# EAGLE design piezo-driver_v0.1-R002 (EAGLE 6.5.0)
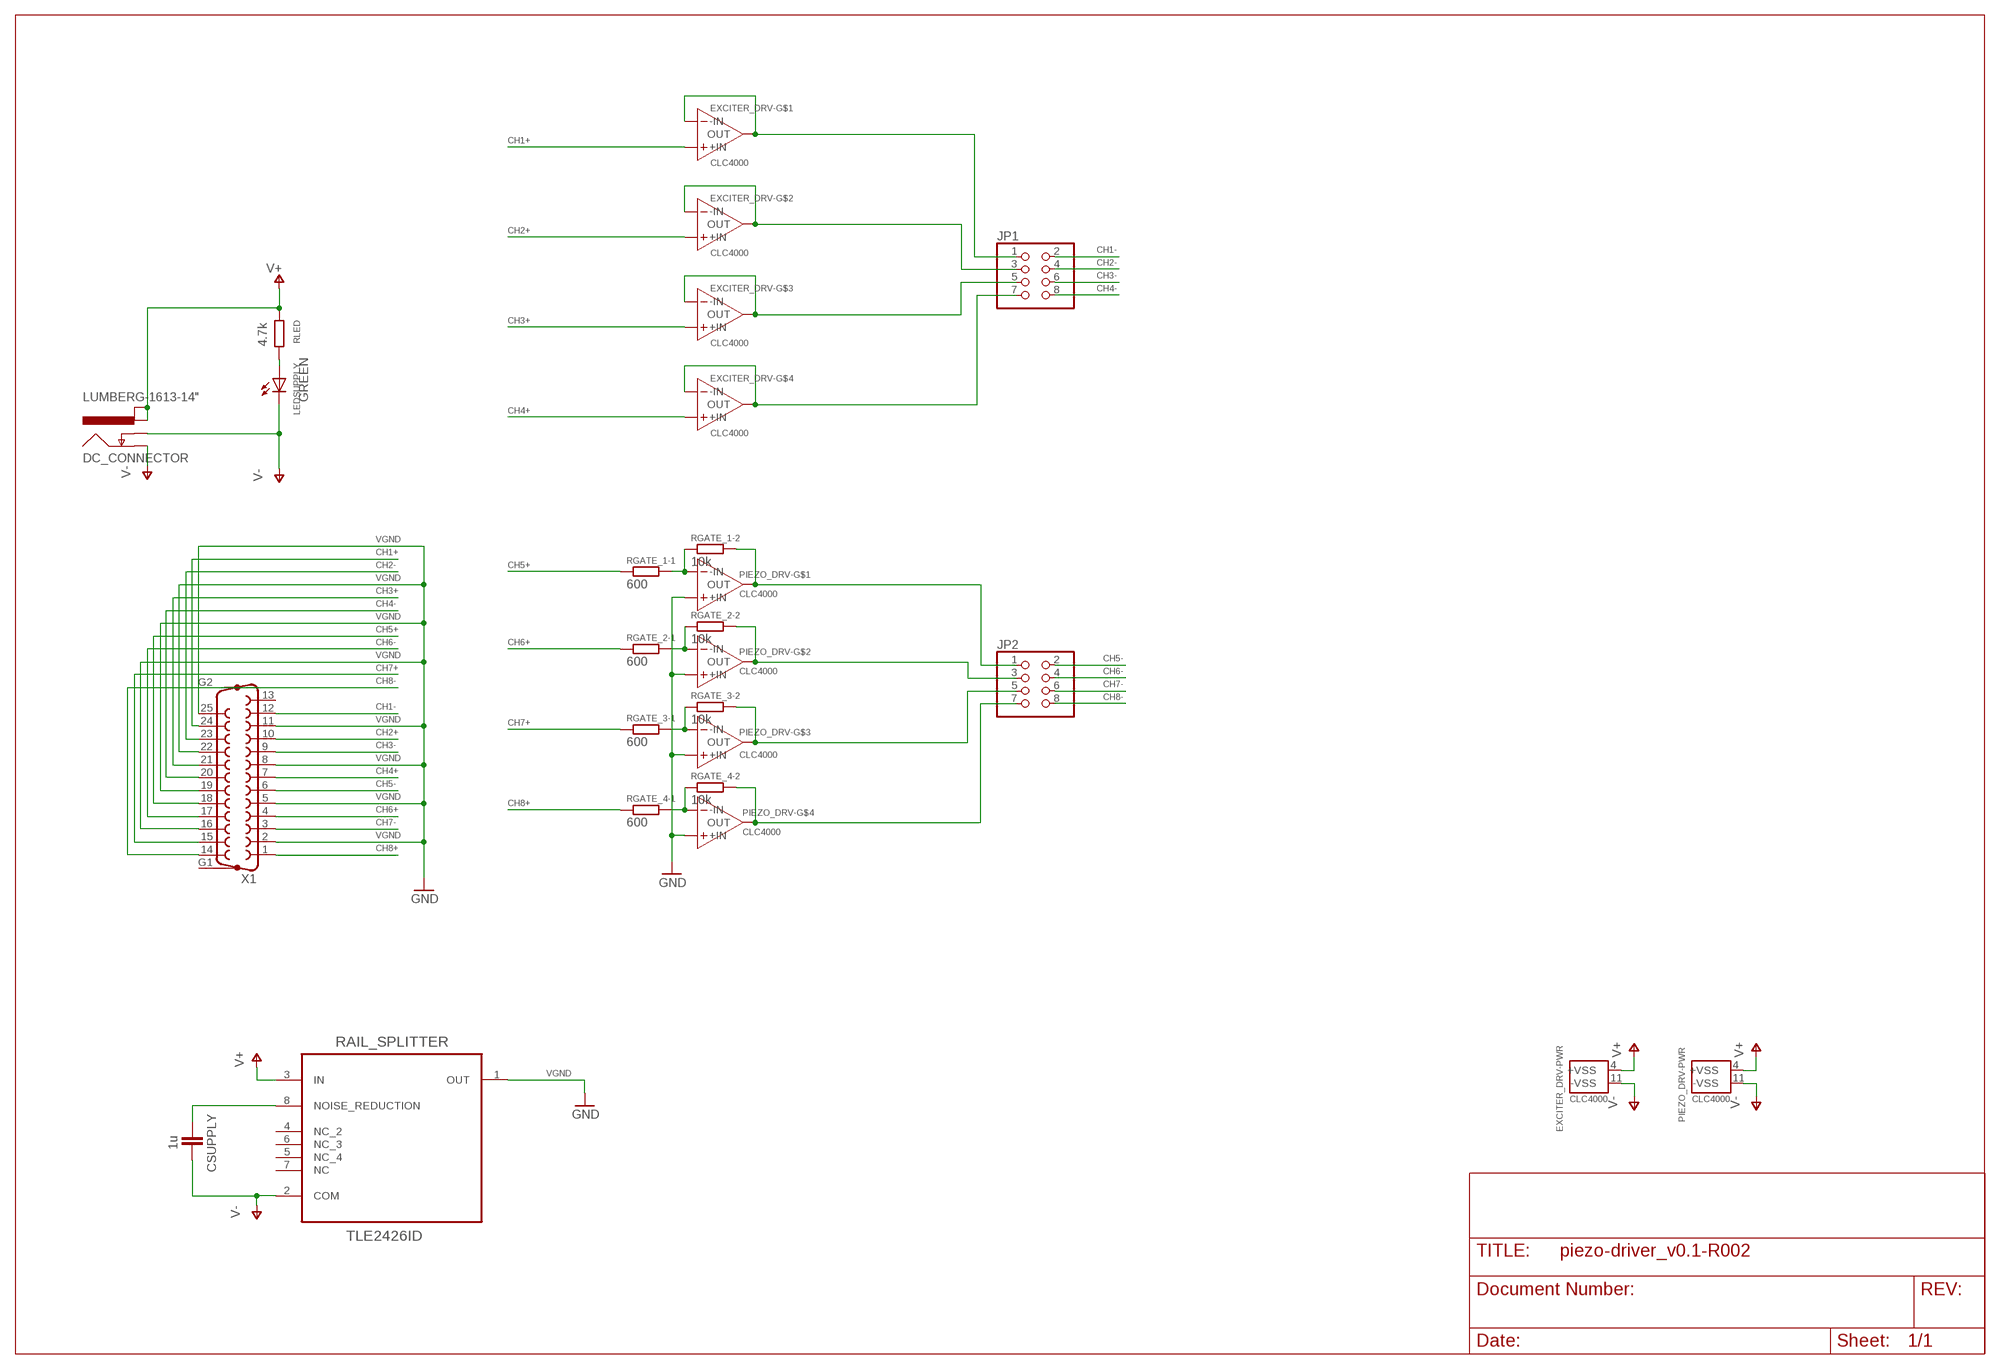
[diagram p0: schematic, sheet 1]

## Parts
CSUPPLY  1u  C-EUC0603  [C0603]
DC_CONNECTOR  LUMBERG-1613-14"  [LUMBERG-1613_14]
EXCITER_DRV  CLC4000  [SOIC-14]
JP1  PINHD-2X4/90  [2X04/90]
JP2  PINHD-2X4/90  [2X04/90]
LEDSUPPLY  GREEN  LED3MM  [LED3MM]
PIEZO_DRV  CLC4000  [SOIC-14]
RAIL_SPLITTER  TLE2426ID  [SOIC127P600X175-8N]
RGATE_1-1  600  R-EU_R0805  [R0805]
RGATE_1-2  10k  R-EU_R0805  [R0805]
RGATE_2-1  600  R-EU_R0805  [R0805]
RGATE_2-2  10k  R-EU_R0805  [R0805]
RGATE_3-1  600  R-EU_R0805  [R0805]
RGATE_3-2  10k  R-EU_R0805  [R0805]
RGATE_4-1  600  R-EU_R0805  [R0805]
RGATE_4-2  10k  R-EU_R0805  [R0805]
RLED  4.7k  R-EU_R0805  [R0805]
X1  F25HP  [F25HP]

## Nets
CH1+: EXCITER_DRV.3(-G$1:+IN) X1.24
CH1-: JP1.2 X1.12
CH2+: EXCITER_DRV.5(-G$2:+IN) X1.10
CH2-: JP1.4 X1.23
CH3+: EXCITER_DRV.10(-G$3:+IN) X1.21
CH3-: JP1.6 X1.9
CH4+: EXCITER_DRV.12(-G$4:+IN) X1.7
CH4-: JP1.8 X1.20
CH5+: RGATE_1-1.1 X1.18
CH5-: JP2.2 X1.6
CH6+: RGATE_2-1.1 X1.4
CH6-: JP2.4 X1.17
CH7+: RGATE_3-1.1 X1.15
CH7-: JP2.6 X1.3
CH8+: RGATE_4-1.1 X1.1
CH8-: JP2.8 X1.14
N$1: EXCITER_DRV.1(-G$1:OUT) EXCITER_DRV.2(-G$1:-IN) JP1.1
N$2: EXCITER_DRV.6(-G$2:-IN) EXCITER_DRV.7(-G$2:OUT) JP1.3
N$3: EXCITER_DRV.8(-G$3:OUT) EXCITER_DRV.9(-G$3:-IN) JP1.5
N$4: EXCITER_DRV.13(-G$4:-IN) EXCITER_DRV.14(-G$4:OUT) JP1.7
N$5: CSUPPLY.1 RAIL_SPLITTER.8(NOISE_REDUCTION)
N$6: PIEZO_DRV.2(-G$1:-IN) RGATE_1-1.2 RGATE_1-2.1
N$7: JP2.1 PIEZO_DRV.1(-G$1:OUT) RGATE_1-2.2
N$8: PIEZO_DRV.6(-G$2:-IN) RGATE_2-1.2 RGATE_2-2.1
N$9: JP2.3 PIEZO_DRV.7(-G$2:OUT) RGATE_2-2.2
N$10: PIEZO_DRV.9(-G$3:-IN) RGATE_3-1.2 RGATE_3-2.1
N$11: JP2.5 PIEZO_DRV.8(-G$3:OUT) RGATE_3-2.2
N$12: PIEZO_DRV.13(-G$4:-IN) RGATE_4-1.2 RGATE_4-2.1
N$13: JP2.7 PIEZO_DRV.14(-G$4:OUT) RGATE_4-2.2
N$15: LEDSUPPLY.A RLED.1
V+: DC_CONNECTOR.3(PWR_1) DC_CONNECTOR.4(PWR_2) EXCITER_DRV.4(-PWR:+VSS) PIEZO_DRV.4(-PWR:+VSS) RAIL_SPLITTER.3(IN) RLED.2
V-: CSUPPLY.2 DC_CONNECTOR.1(GND) DC_CONNECTOR.2(GND_INS) EXCITER_DRV.11(-PWR:-VSS) LEDSUPPLY.K(C) PIEZO_DRV.11(-PWR:-VSS) RAIL_SPLITTER.2(COM)
VGND: PIEZO_DRV.3(-G$1:+IN) PIEZO_DRV.5(-G$2:+IN) PIEZO_DRV.10(-G$3:+IN) PIEZO_DRV.12(-G$4:+IN) RAIL_SPLITTER.1(OUT) X1.2 X1.5 X1.8 X1.11 X1.16 X1.19 X1.22 X1.25 ; supply symbol labelled GND
Unconnected: RAIL_SPLITTER.4(NC_2) RAIL_SPLITTER.5(NC_4) RAIL_SPLITTER.6(NC_3) RAIL_SPLITTER.7(NC) X1.13 X1.G1 X1.G2

## Library data of the parts
CSUPPLY = rcl:C-EU: CAPACITOR, European symbol
DC_CONNECTOR = SABRe:LUMBERG-1613-14
EXCITER_DRV PIEZO_DRV = ICST:CLC4000
JP1 JP2 = ICST:PINHD-2X4: PIN HEADER
LEDSUPPLY = SABRe:LED: LEDs Standard schematic elements and footprints for packages: 5mm 3mm 1206 0603
RAIL_SPLITTER = Texas Instruments_By_element14_Batch_1:TLE2426ID: PRECISION VIRTUAL GROUND; MPN: TLE2426ID; OC_FARNELL: 8454833; OC_NEWARK: 35K1234; PACKAGE: SOIC-8; SUPPLIER: Texas Instruments
RGATE_1-1 RGATE_1-2 RGATE_2-1 RGATE_2-2 RGATE_3-1 RGATE_3-2 RGATE_4-1 RGATE_4-2 RLED = rcl:R-EU_: RESISTOR, European symbol
X1 = ICST:F25HP: SUB-D; OC_FARNELL: unknown; OC_NEWARK: unknown

## Board
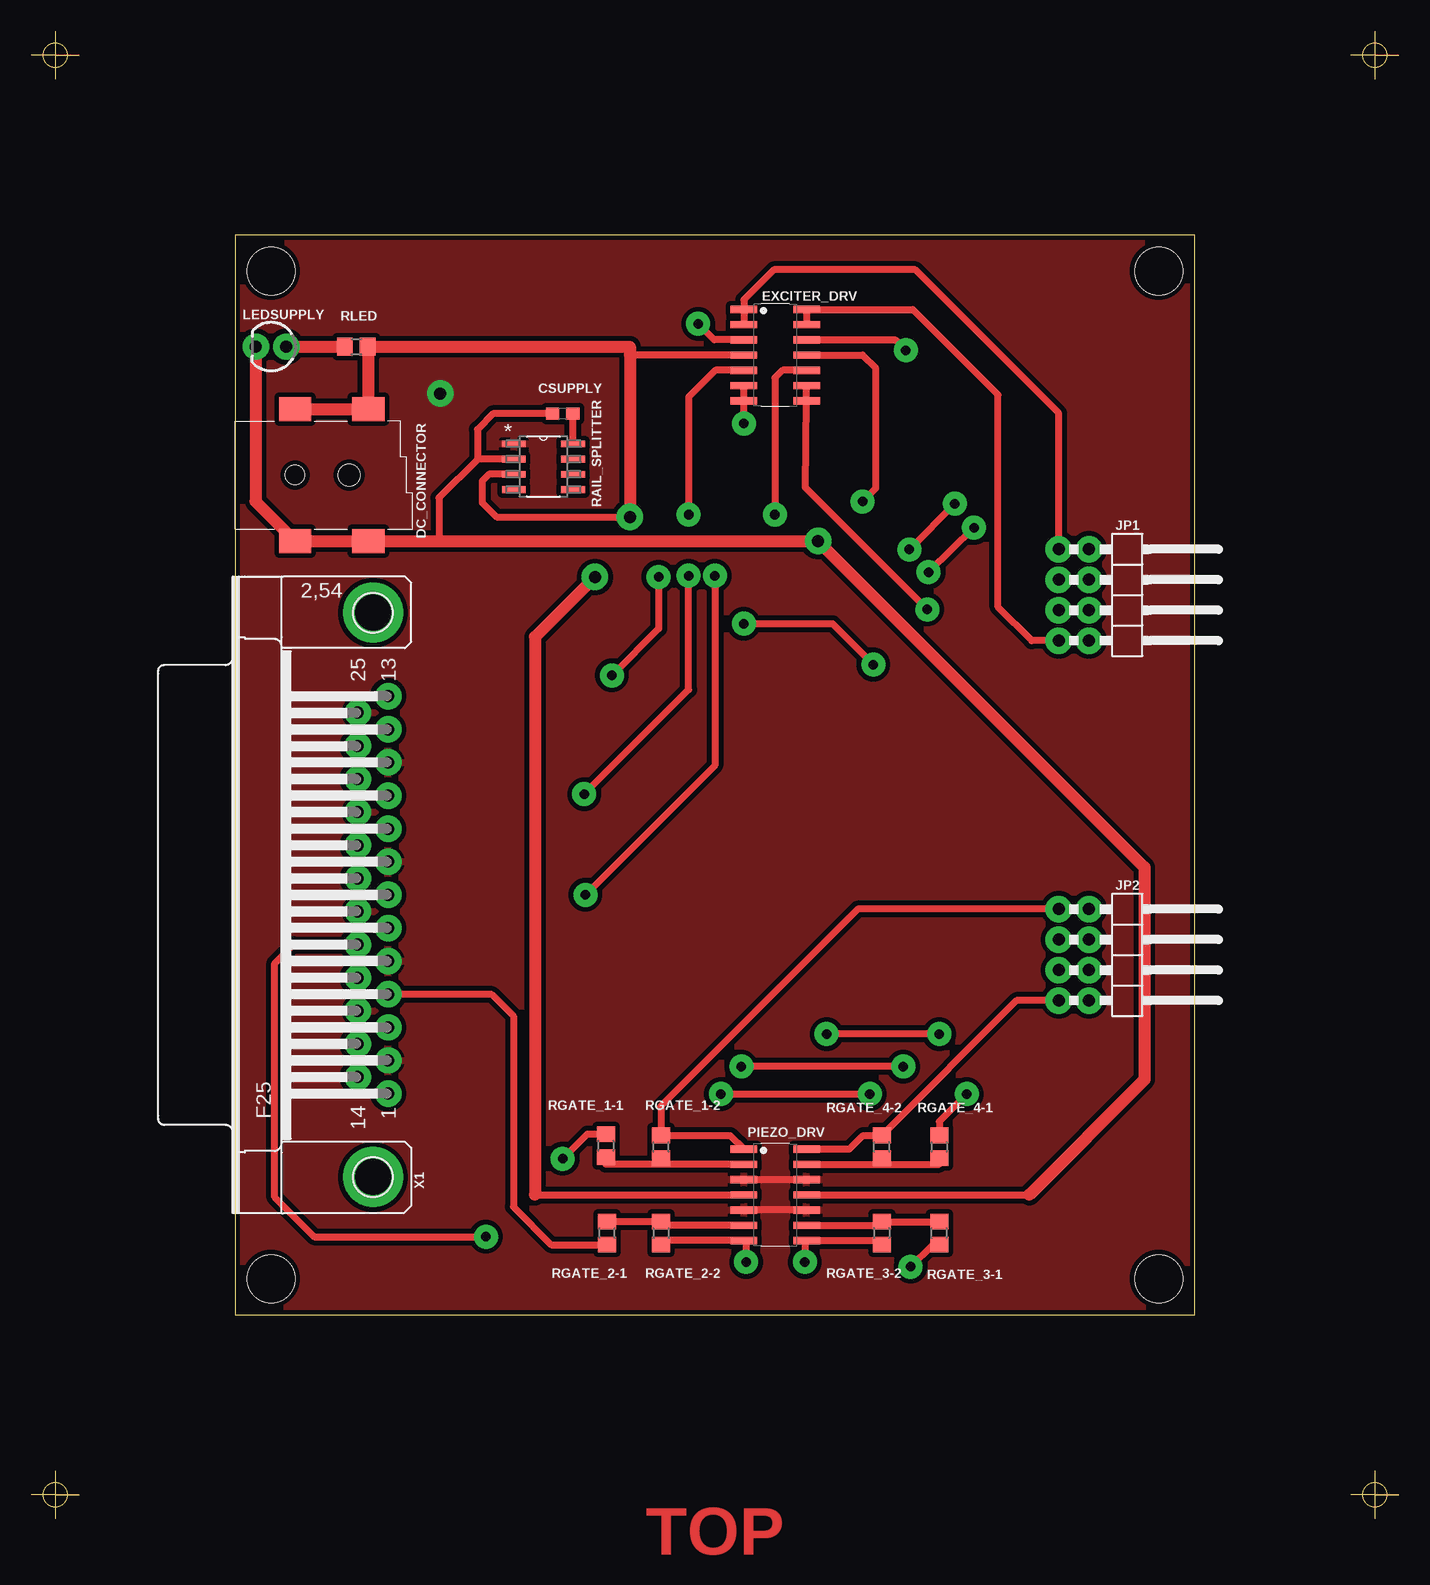
[diagram p1: board, top side]
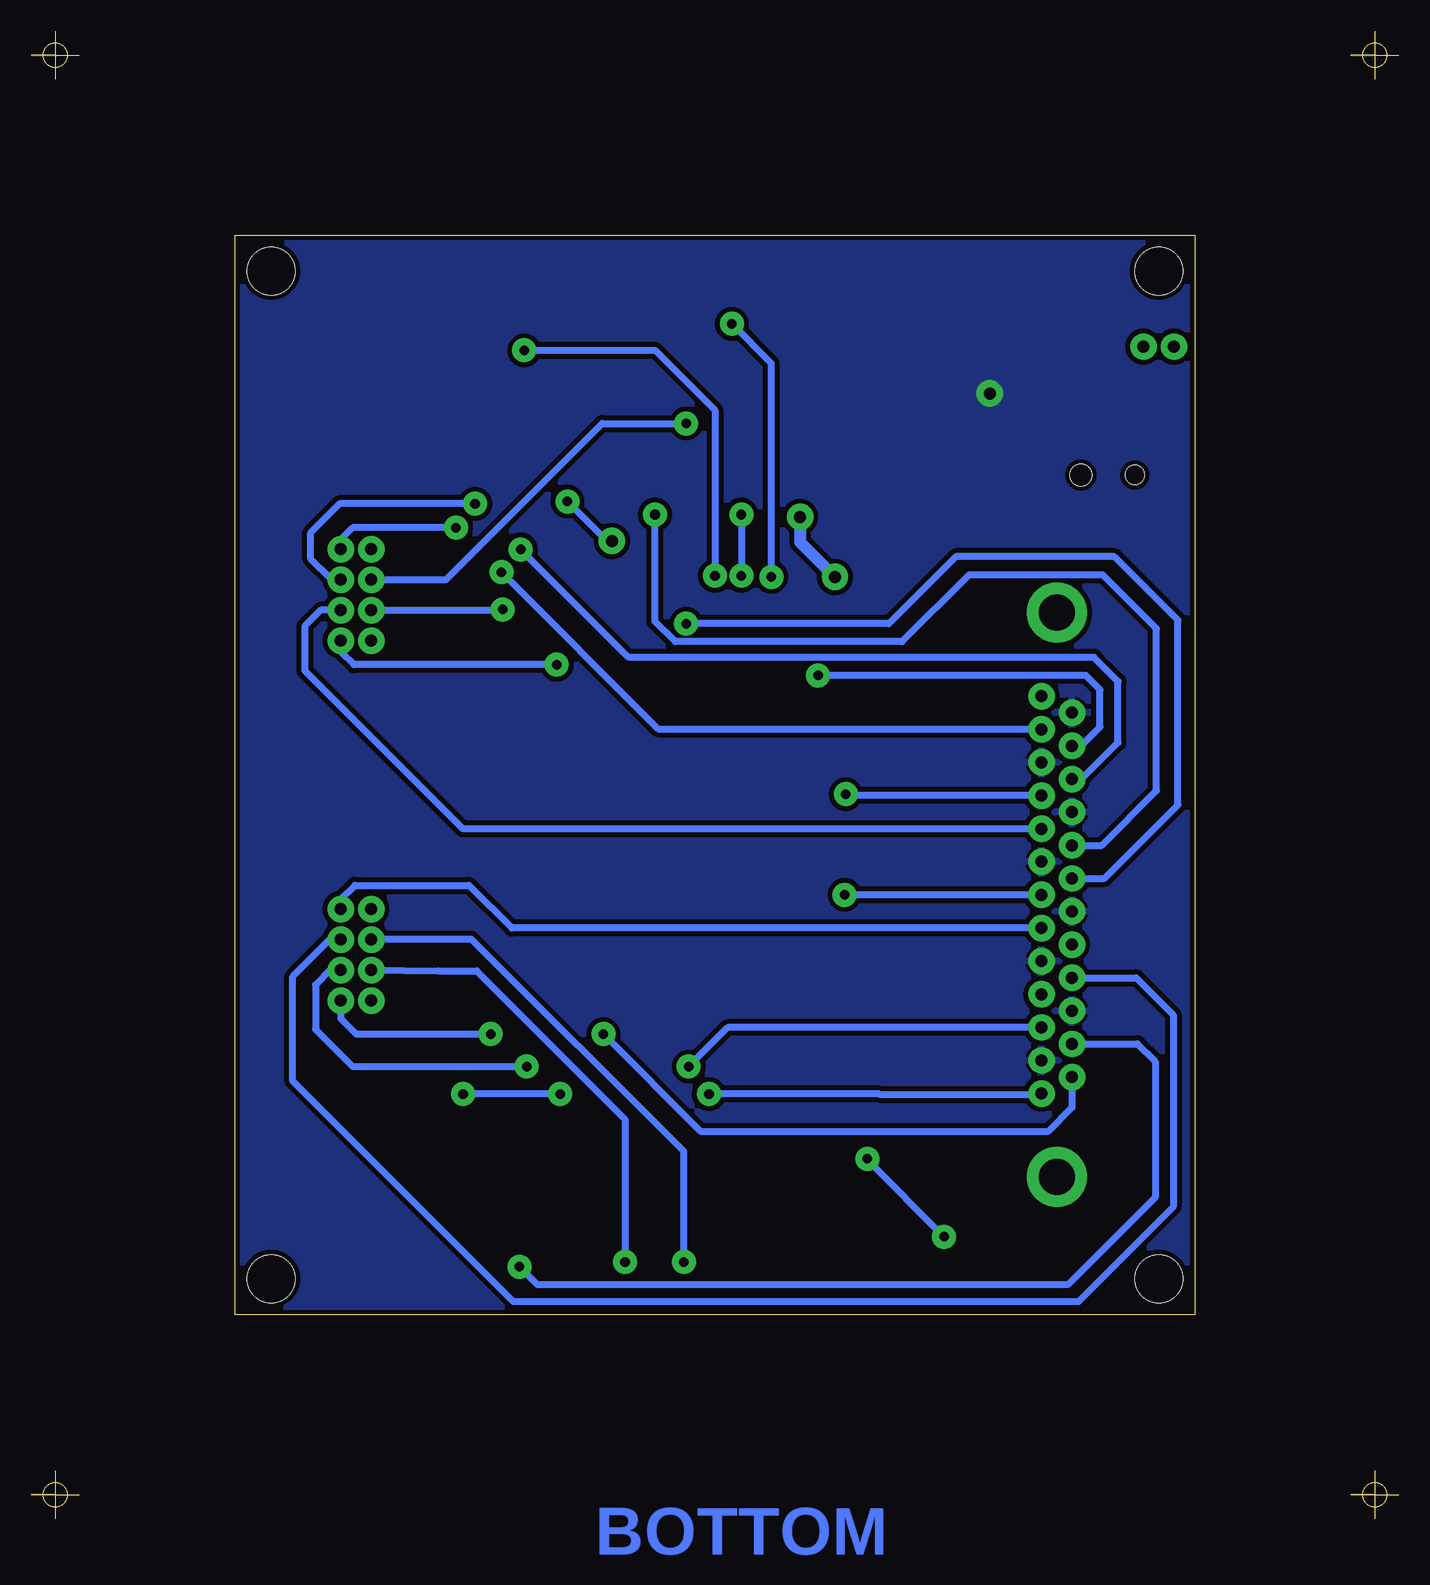
[diagram p2: board, bottom side, seen from below]

Size 114 x 124 mm. Coordinates in mm from the lower left corner, seen from the top.
Outline: 2,2 4,2
Outline: 2,4 2,2
Outline: 2,2 2,0
Outline: 2,2 0,2
Outline: 112,2 114,2
Outline: 112,4 112,2
Outline: 112,2 112,0
Outline: 112,2 110,2
Outline: 2,122 4,122
Outline: 2,124 2,122
Outline: 2,122 2,120
Outline: 2,122 0,122
Outline: 112,122 114,122
Outline: 112,124 112,122
Outline: 112,122 112,120
Outline: 112,122 110,122
Outline: 17,107 17,17 97,17 97,107 17,107
Outline: circle at 2,2 radius 1
Outline: circle at 112,2 radius 1
Outline: circle at 2,122 radius 1
Outline: circle at 112,122 radius 1
Copper layers (1*16): Top 0mil / dielectric 0.8mm / Bottom 0.035mm
Design rules "ICST_gravur *": minimum track width 0.4mm, minimum drill 0.4mm, track to track 0.15mm, track to pad 0.15mm, pad to pad 0.15mm, via to via 0.15mm, smd to smd 0mil, copper to edge 0.2mm, drill to drill 0.2mm, minimum pad ring 0.1mm, minimum via ring 0.1mm, stop-mask expansion 0.15mm, vias tented up to drill 0.3mm, thermal gap 0.25mm
Holes 4 mm at 20,104 94,104 94,20 20,20

### Footprints (pad centres in the part's own frame; a part is rotated, then mirrored left to right if it is on the bottom)
C0603 = smd 1.1 x 1: 1 -0.85,0; 2 0.85,0
LUMBERG-1613_14 = smd 2 x 2.7: 1 5.5,5; 2 5.5,11.1; 3 -5.5,11.1; 4 -5.5,5 | hole 1.6: 0,5 | hole 1.8: 0,9.5
SOIC-14 = smd 0.61 x 2.21: 1 -3.81,-2.591; 2 -2.54,-2.591; 3 -1.27,-2.591; 4 0,-2.591; 5 1.27,-2.591; 6 2.54,-2.591; 7 3.81,-2.591; 8 3.81,2.642; 9 2.54,2.642; 10 1.27,2.642; 11 0,2.642; 12 -1.27,2.642; 13 -2.54,2.642; 14 -3.81,2.642
2X04/90 = drill 1: 1 -3.81,-6.35; 2 -3.81,-3.81; 3 -1.27,-6.35; 4 -1.27,-3.81; 5 1.27,-6.35; 6 1.27,-3.81; 7 3.81,-6.35; 8 3.81,-3.81
LED3MM = drill 1: A -1.27,0; K 1.27,0
SOIC127P600X175-8N = smd 1.981 x 0.559: 1 -2.464,1.905; 2 -2.464,0.635; 3 -2.464,-0.635; 4 -2.464,-1.905; 5 2.464,-1.905; 6 2.464,-0.635; 7 2.464,0.635; 8 2.464,1.905
R0805 = smd 1.3 x 1.5: 1 -0.95,0; 2 0.95,0
F25HP = drill 1: 1 -16.561,-1.27; 2 -13.792,-1.27; 3 -11.049,-1.27; 4 -8.28,-1.27; 5 -5.512,-1.27; 6 -2.769,-1.27; 7 0,-1.27; 8 2.769,-1.27; 9 5.512,-1.27; 10 8.28,-1.27; 11 11.049,-1.27; 12 13.792,-1.27; 13 16.561,-1.27; 14 -15.189,1.27; 15 -12.421,1.27; 16 -9.652,1.27; 17 -6.909,1.27; 18 -4.14,1.27; 19 -1.372,1.27; 20 1.372,1.27; 21 4.14,1.27; 22 6.909,1.27; 23 9.652,1.27; 24 12.421,1.27; 25 15.189,1.27 | drill 3 pad 5: G1 -23.52,0; G2 23.52,0

### Placement (x,y rotation side)
CSUPPLY  44.3,92.1 180 top
DC_CONNECTOR  17,87 270 top
EXCITER_DRV  62,97 270 top
JP1  92,77 270 top
JP2  92,47 270 top
LEDSUPPLY  20,97.7 180 top
PIEZO_DRV  62,27 270 top
RAIL_SPLITTER  42.7,87.7 0 top
RGATE_1-1  47.9,31.1 270 top
RGATE_1-2  52.5,31 90 top
RGATE_2-1  48,23.8 90 top
RGATE_2-2  52.5,23.8 270 top
RGATE_3-1  75.7,23.8 90 top
RGATE_3-2  70.9,23.8 270 top
RGATE_4-1  75.7,31 270 top
RGATE_4-2  70.9,31 90 top
RLED  27.1,97.7 0 top
X1  28.5,52 90 top

### Tracks (layer width: path | path; a pad name or v marks a point on that pad's centre or on a via)
CH1+  (via drill 0.8)
  Top 0.6: EXCITER_DRV.3 56.93,98.27 v55.6,99.6 | v52.3,78.5 52.3,74.2 v48.4,70.3
  Bottom 0.6: v52.3,78.5 52.3,96.3 v55.6,99.6 | v48.4,70.3 26.1,70.3 24.9,69.1 24.9,66 26.48,64.42 X1.24
CH1-  (via drill 0.8)
  Top 0.6: v78.6,82.6 v74.8,78.9
  Bottom 0.6: v78.6,82.6 87.2,82.6 88.19,81.61 JP1.2 | v74.8,78.9 61.74,65.84 29.77,65.84 X1.12
CH2+  (via drill 0.8)
  Top 0.6: EXCITER_DRV.5 57.03,95.73 54.8,93.5 v54.8,83.7 | v54.8,78.6 54.8,69.1 v46.1,60.4
  Bottom 0.6: v54.8,83.7 v54.8,78.6 | 46.01,60.31 v46.1,60.4 45.98,60.28 X1.10
CH2-  (via drill 0.8)
  Top 0.6: v77,84.6 v73.2,80.8
  Bottom 0.6: v77,84.6 88.3,84.6 90.7,82.2 90.7,80 88.97,78.27 JP1.4 | v73.2,80.8 64.2,71.8 25.4,71.8 23.4,69.8 23.4,64.7 26.45,61.65 X1.23
CH3+  (via drill 0.8)
  Top 0.6: EXCITER_DRV.10 62.63,95.73 62,95.1 v62,83.7
  Bottom 0.6: v62,83.7 62,74.8 60.3,73.1 41.4,73.1 35.8,78.7 24.7,78.7 20.2,74.2 20.2,60.7 24.76,56.14 X1.21
CH3-
  Bottom 0.6: JP1.6 89.87,75.73 91.2,74.4 91.2,70.7 78.01,57.51 X1.9
CH4+  (via drill 0.8)
  Top 0.6: EXCITER_DRV.12 72.03,98.27 v72.9,97.4 | v57,78.6 57,62.8 v46.2,52
  Bottom 0.6: v72.9,97.4 62,97.4 57,92.4 v57,78.6 | X1.7 v46.2,52
CH4-  (via drill 0.8)
  Top 0.6: v59.4,74.6 66.8,74.6 v70.2,71.2
  Bottom 0.6: v70.2,71.2 87.1,71.2 88.19,72.29 JP1.8 | X1.20 24.53,53.37 18.4,59.5 18.4,74.9 23.7,80.2 36.9,80.2 42.5,74.6 v59.4,74.6
CH5+  (via drill 0.8)
  Top 0.6: RGATE_1-1.1 46.35,32.05 v44.3,30 | X1.18 27.22,47.85 21.85,47.85 20.3,46.3 20.3,26.8 23.6,23.5 v37.9,23.5
  Bottom 0.6: v37.9,23.5 44.3,29.9 v44.3,30
CH5-
  Bottom 0.6: JP2.2 88.19,51.61 87,52.8 77.5,52.8 73.93,49.23 X1.6
CH6+
  Top 0.6: 48,22.9 RGATE_2-1.1 43.35,22.85 40.2,26 40.2,41.9 38.41,43.69 29.8,43.69 X1.4
CH6-
  Bottom 0.6: JP2.4 89.13,48.27 92.2,45.2 92.2,36.5 73.8,18.1 26.7,18.1 18.8,26 18.8,42 21.89,45.09 X1.17
CH7+  (via drill 0.8)
  Top 0.6: v73.3,21 75.15,22.85 RGATE_3-1.1
  Bottom 0.6: v73.3,21 71.8,19.5 27.6,19.5 20.3,26.8 20.3,38.1 21.78,39.58 X1.15
CH7-  (via drill 0.8)
  Top 0.6: v72.7,37.7 v59.2,37.7
  Bottom 0.6: v59.2,37.7 55.95,40.95 X1.3 | v72.7,37.7 87.2,37.7 90.3,40.8 90.3,44.5 89.07,45.73 JP2.6
CH8+  (via drill 0.8)
  Top 0.6: v57.5,35.4 v69.9,35.4 | v78,35.4 75.7,33.1 RGATE_4-1.1
  Bottom 0.6: v57.5,35.4 43.3,35.4 43.29,35.39 29.82,35.39 X1.1 | v69.9,35.4 v78,35.4
CH8-  (via drill 0.8)
  Top 0.6: v75.7,40.4 v66.3,40.4
  Bottom 0.6: JP2.8 88.19,41.69 86.9,40.4 v75.7,40.4 | v66.3,40.4 58.2,32.3 29.2,32.3 27.23,34.27 X1.14
N$1
  Top 0.6: EXCITER_DRV.2 EXCITER_DRV.1 59.41,101.61 61.9,104.1 73.7,104.1 85.65,92.15 JP1.1
N$2  (via drill 0.8)
  Top 0.6: EXCITER_DRV.6 EXCITER_DRV.7 v59.4,91.3
  Bottom 0.6: JP1.3 79.43,78.27 66.4,91.3 v59.4,91.3
N$3  (via drill 0.8)
  Top 0.6: EXCITER_DRV.9 EXCITER_DRV.8 64.54,85.96 v74.7,75.8
  Bottom 0.6: JP1.5 74.77,75.73 v74.7,75.8
N$4
  Top 0.6: EXCITER_DRV.13 EXCITER_DRV.14 64.65,100.8 73.5,100.8 80.6,93.7 80.6,76 83.41,73.19 JP1.7
N$5
  Top 0.6: RAIL_SPLITTER.8 CSUPPLY.1
N$6
  Top 0.6: PIEZO_DRV.2 52.4,29.54 | 52.4,29.54 47.9,29.54 RGATE_1-1.2 | RGATE_1-2.1 52.4,30.05 52.4,29.54
N$7
  Top 0.6: JP2.1 68.91,50.81 52.5,34.4 RGATE_1-2.2 58.27,31.95 PIEZO_DRV.1
N$8
  Top 0.6: 47.95,24.75 RGATE_2-2.1 52.5,24.46 PIEZO_DRV.6
  Top 0.8: 47.95,24.75 RGATE_2-1.2
N$9  (via drill 0.8)
  Top 0.6: RGATE_2-2.2 52.5,23.19 PIEZO_DRV.7 59.6,23.19 v59.6,21.4
  Bottom 0.6: v59.6,21.4 59.6,30.6 77.3,48.3 85.62,48.3 JP2.3
N$10
  Top 0.6: PIEZO_DRV.9 70.9,24.46 RGATE_3-2.1 RGATE_3-1.2
N$11  (via drill 0.8)
  Top 0.6: PIEZO_DRV.8 70.9,23.19 RGATE_3-2.2 | 64.5,23.19 PIEZO_DRV.8 | PIEZO_DRV.8 64.5,23.05 v64.5,21.4
  Bottom 0.6: JP2.5 80.07,45.67 76.87,45.67 64.5,33.3 v64.5,21.4
N$12
  Top 0.6: PIEZO_DRV.13 71,29.54 | 71,29.54 75.7,29.54 RGATE_4-1.2 | RGATE_4-2.1 71,30.05 71,29.54
N$13
  Top 0.6: JP2.7 82.14,43.19 RGATE_4-2.2 69.35,31.95 68.21,30.81 PIEZO_DRV.14
N$14
  Top 0.1: 2,124 2,120
N$15
  Top 1: LEDSUPPLY.A RLED.1
N$16
  Top 0.1: 4,122 0,122
N$17
  Bottom 0.1: 2,124 2,120
N$18
  Bottom 0.1: 4,122 0,122
N$19
  Top 0.1: 112,124 112,120
N$20
  Top 0.1: 114,122 110,122
N$21
  Bottom 0.1: 112,124 112,120
N$22
  Bottom 0.1: 114,122 110,122
N$23
  Top 0.1: 2,4 2,0
N$24
  Top 0.1: 4,2 0,2
N$25
  Bottom 0.1: 2,4 2,0
N$26
  Bottom 0.1: 4,2 0,2
N$27
  Top 0.1: 112,4 112,0
N$28
  Top 0.1: 114,2 110,2
N$29
  Bottom 0.1: 112,4 112,0
N$30
  Bottom 0.1: 114,2 110,2
V+  (via drill 1)
  Top 0.6: EXCITER_DRV.4 49.9,97 | 42,27 PIEZO_DRV.4 | v49.9,83.5 38.8,83.5 37.6,84.7 37.6,86.5 38.17,87.06 RAIL_SPLITTER.3
  Top 1: DC_CONNECTOR.4 DC_CONNECTOR.3 | 28.05,92.5 DC_CONNECTOR.3 | v49.9,83.5 49.9,97 49.9,97.7 RLED.2 28.1,97.7 DC_CONNECTOR.3 | v47,78.5 42,73.5 42,27
  Bottom 1: v49.9,83.5 49.9,81.4 v47,78.5
V-  (via drill 0.8, 1)
  Top 0.6: PIEZO_DRV.11 83.2,27 | 33.9,81.5 34,81.6 34,85.1 37.23,88.34 | EXCITER_DRV.11 69.3,97 70.4,95.9 70.4,85.9 v69.3,84.8 | CSUPPLY.2 38.5,92.1 37.2,90.8 37.2,88.37 37.23,88.34 | RAIL_SPLITTER.2 37.23,88.34
  Top 1: 18.73,84.77 DC_CONNECTOR.1 DC_CONNECTOR.2 33.9,81.5 v65.6,81.5 92.8,54.3 92.8,36.6 83.2,27 | 18.73,84.77 18.7,84.8 | LEDSUPPLY.K 18.73,84.77
  Bottom 0.6: v69.3,84.8 66,81.5 v65.6,81.5
VGND  (via drill 1)
  Top 0.6: PIEZO_DRV.3 PIEZO_DRV.12 | PIEZO_DRV.10 PIEZO_DRV.5
  other vias: 34.1,93.8
  pour Top (isolate 0.4): 17,17 17,107 97,107 97,17
  pour Bottom (isolate 0.4): 17,17 17,107 97,107 97,17
(copper drawn outside any net)
  shapes: Bottom circle x4, Top circle x4

### Text on the board
Top: TOP
Bottom: BOTTOM